# Altium schematic sheet rotary-encoder.SchDoc
size A4; SheetNumber: 9; SheetTotal: 9
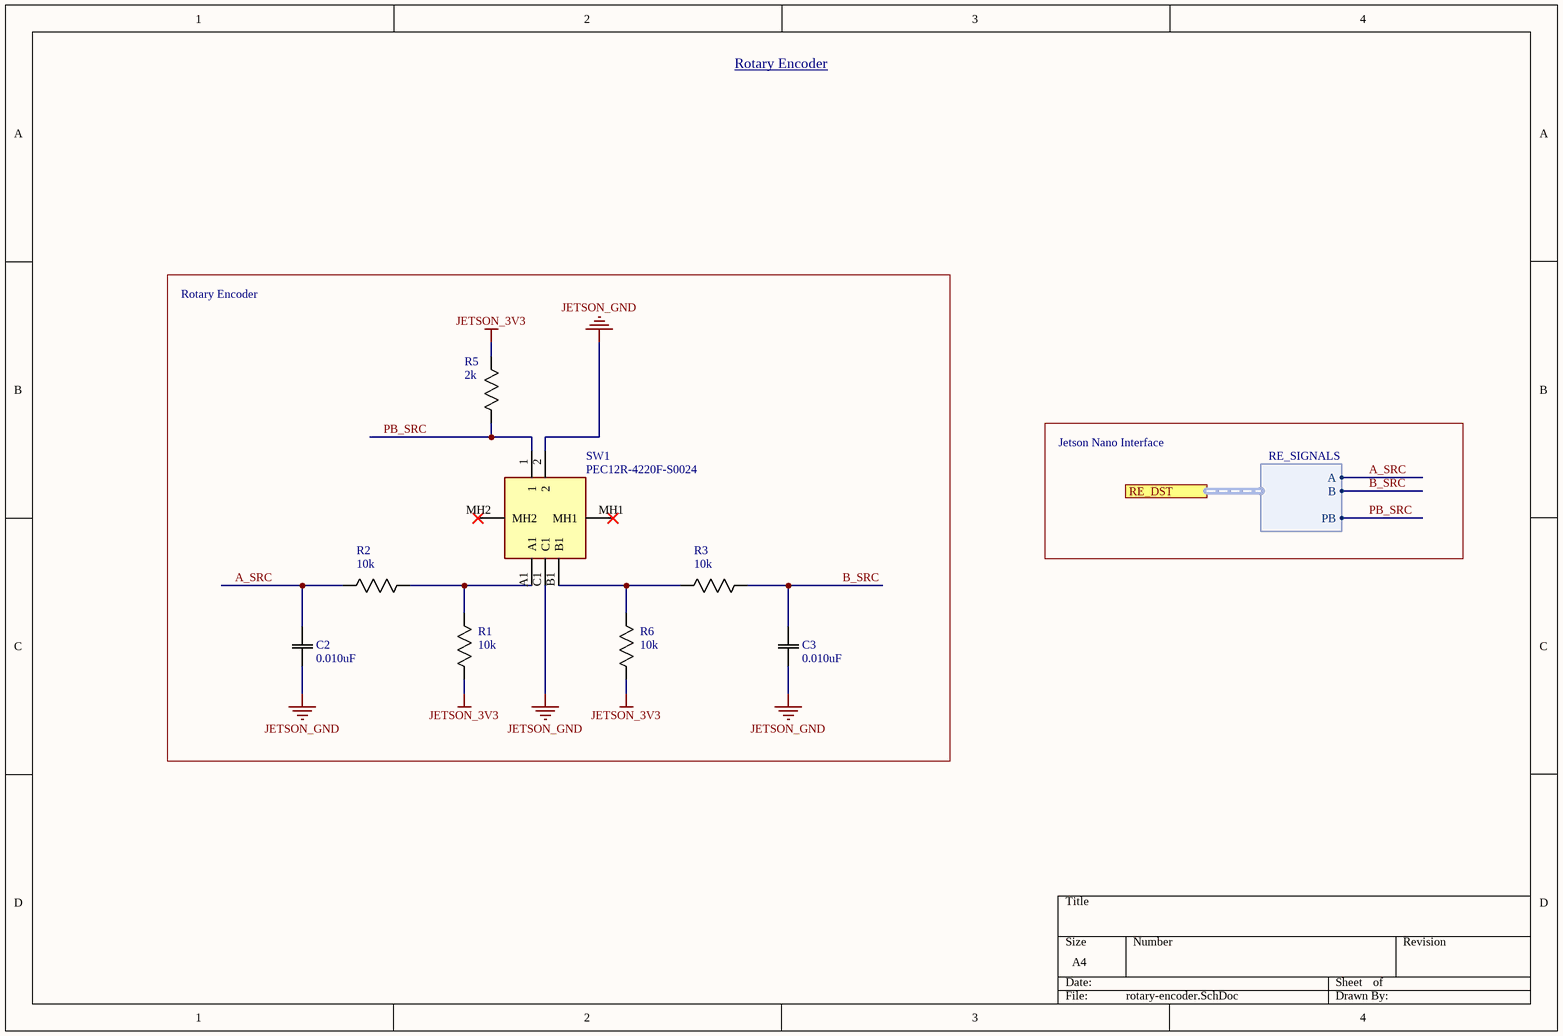
[diagram p0: rotary-encoder.SchDoc]

## Parts
C2  0.010uF  [0603]
C3  0.010uF  [0603]
R1  10k  [0805]
R2  10k  [0805]
R3  10k  [0805]
R5  2k  [0603]
R6  10k  [0805]
SW1  PEC12R-4220F-S0024  [PEC12R4220FS0024]

## Blocks framed on the sheet
Rotary Encoder: C2 C3 R1-R3 R5 R6 SW1

## Ports
RE_DST (harness RE_SIGNALS)

## Harnesses
RE_SIGNALS: A, B, PB

## Nets
JETSON_3V3: R1.2(R2) R5.1(R1) R6.2(R2)
JETSON_GND: C2.1(C1) C3.1(C1) SW1.2 SW1.C1
A_SRC: C2.2(C2) R2.2(R2) ; port RE_DST.A
B_SRC: C3.2(C2) R3.1(R1) ; port RE_DST.B
PB_SRC: R5.2(R2) SW1.1 ; port RE_DST.PB
NetR1_1: R1.1(R1) R2.1(R1) SW1.A1
NetR3_2: R3.2(R2) R6.1(R1) SW1.B1

Not connected (* = marked no-connect by the designer): SW1 MH1* MH2*

## Notes on the sheet
- Rotary Encoder
- Jetson Nano Interface

## Library data of the parts
C2 C3 = CAP 0.010uF 16V: CAP CER 0.010UF 16V X5R 0603/0805; Tolerance: 10%; Value: 0.010uF; Temperature Coefficient: X5R; Rating: 16V; Part Number: CAP 0.010uF 16V; Package: 0603/0805; Operating Temperature: -55°C ~ 85°C
R1-R3 R6 = RES 10k 1/8W 1%: RES SMD 10K OHM 1% 1/8W 0805; Manufacturer Part Number 1: ERJ-H3GJ103V; Power (Watts): 0.125W; Tolerance: 5%; Package: 0805; Value: 10k; Part Number: RES 10k 1/8W 1%; Supplier 1: Digi-Key; Supplier Part Number 1: 10-ERJ-H3GJ103VCT-ND; Supplier URL 1: https://www.digikey.ca/en/products/detail/panasonic-electronic-components/ERJ-H3GJ103V/13877876?s=N4IgTCBcDaIIwAYC0BRASgKSQCQMwHENFcA1AYQBUkA5AERAF0BfIA; Manufacturer Part Number 2: RMCF0805JT10K0; Supplier 2: Digi-Key; Supplier Part Number 2: RMCF0805JT10K0CT-ND; Supplier URL 2: https://www.digikey.ca/en/products/detail/stackpole-electronics-inc/RMCF0805JT10K0/1757762?s=N4IgTCBcDaIEoFkDCAxADADjQVgFIBUBGNAaTSXxAF0BfIA; Tolerance 2: 5%
R5 = RES 2k 1/8W: RES SMD 2K OHM 5% 1/8W 0805; Power (Watts): 0.125W; Package: 0805; Value: 2k; Tolerance: 5%; Part Number: RES 2k 1/8W
SW1 = PEC12R4220FS0024: Rotary Encoder; Manufacturer_Name: Bourns; Datasheet Link: https://componentsearchengine.com/Datasheets/5/PEC12R-4220F-S0024.pdf; Height: 20mm; Manufacturer_Part_Number: PEC12R-4220F-S0024; Mouser Part Number: 652-PEC12R-4220F-S24; Mouser Price/Stock: https://www.mouser.co.uk/ProductDetail/Bourns/PEC12R-4220F-S0024?qs=Zq5ylnUbLm7u%2FuPQvUoR4Q%3D%3D; Arrow Part Number: PEC12R-4220F-S0024; Arrow Price/Stock: https://www.arrow.com/en/products/pec12r-4220f-s0024/bourns; Part Number: PEC12R4220FS0024; Supplier 1: Digi-key; Supplier Part Number 1: PEC12R-4220F-S0024-ND; Supplier URL 1: https://www.digikey.ca/en/products/detail/bourns-inc/PEC12R-4220F-S0024/4499653